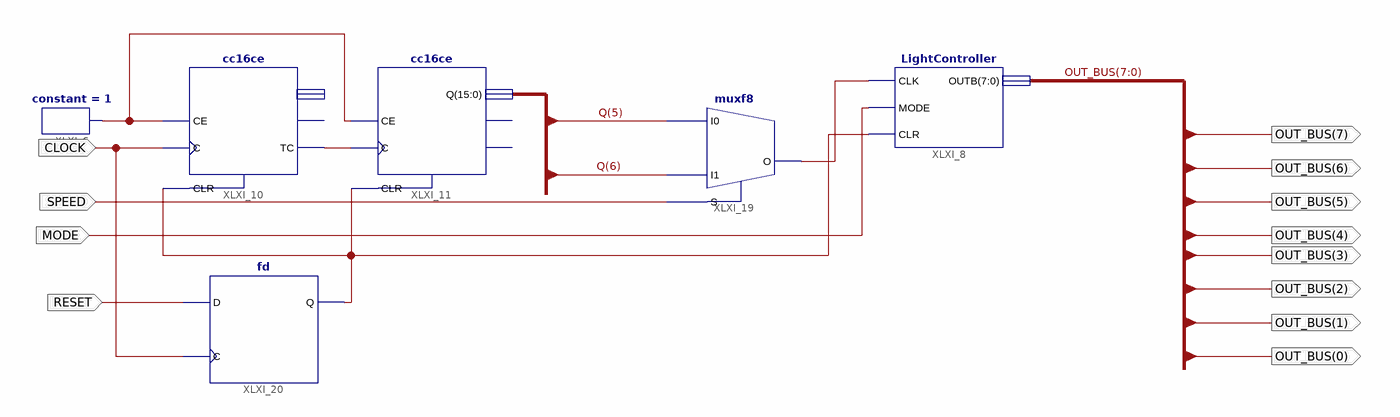
[diagram p0: schematic sheet 1]
// Xilinx ISE schematic TopLevel.sch (spartan3a) as structural Verilog: 6 symbols, 12 ports
module TopLevel (
  input  CLOCK,
  input  SPEED,
  input  MODE,
  input  RESET,
  output [7:0] OUT_BUS
);

  wire XLXN_1, XLXN_12, XLXN_29, XLXN_34;
  wire [15:0] Q;

  LightController XLXI_8 (.MODE(MODE), .CLK(XLXN_29), .CLR(XLXN_34), .OUTB(OUT_BUS));
  muxf8 XLXI_19 (.I0(Q[5]), .I1(Q[6]), .S(SPEED), .O(XLXN_29));
  constant #(.CValue("1")) XLXI_6 (.O(XLXN_12));
  cc16ce XLXI_10 (.C(CLOCK), .CE(XLXN_12), .CLR(XLXN_34), .TC(XLXN_1));  // open: CEO, Q
  cc16ce XLXI_11 (.C(XLXN_1), .CE(XLXN_12), .CLR(XLXN_34), .Q(Q));  // open: CEO, TC
  fd XLXI_20 (.C(CLOCK), .D(RESET), .Q(XLXN_34));
endmodule
